# Altium schematic sheet LDR.schdoc
size 59 x 47 mm
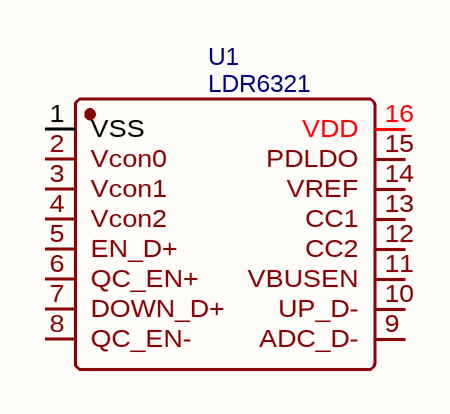
[diagram p0: LDR.schdoc]

## Parts
U1  LDR6321  [SSOP-16_L5.0-W4.4-P0.65-LS6.4-BL]

## Nets

Not connected (* = marked no-connect by the designer): U1 1(VSS) 2(Vcon0) 3(Vcon1) 4(Vcon2) 5(EN_D+) 6(QC_EN+) 7(DOWN_D+) 8(QC_EN-) 9(ADC_D-) 10(UP_D-) 11(VBUSEN) 12(CC2) 13(CC1) 14(VREF) 15(PDLDO) 16(VDD)

## Library data of the parts
U1 = LDR6321: BOM_Manufacturer: Legendary(乐得瑞); Contributor: LCSC; BOM_Supplier: LCSC; BOM_Supplier Part: C2919632; BOM_Manufacturer Part: LDR6321; BOM_JLCPCB Part Class: Extended Part; spicePre: U; spiceSymbolName: LDR6321